# Altium project STM8L-Nrf-remote.PrjPcb
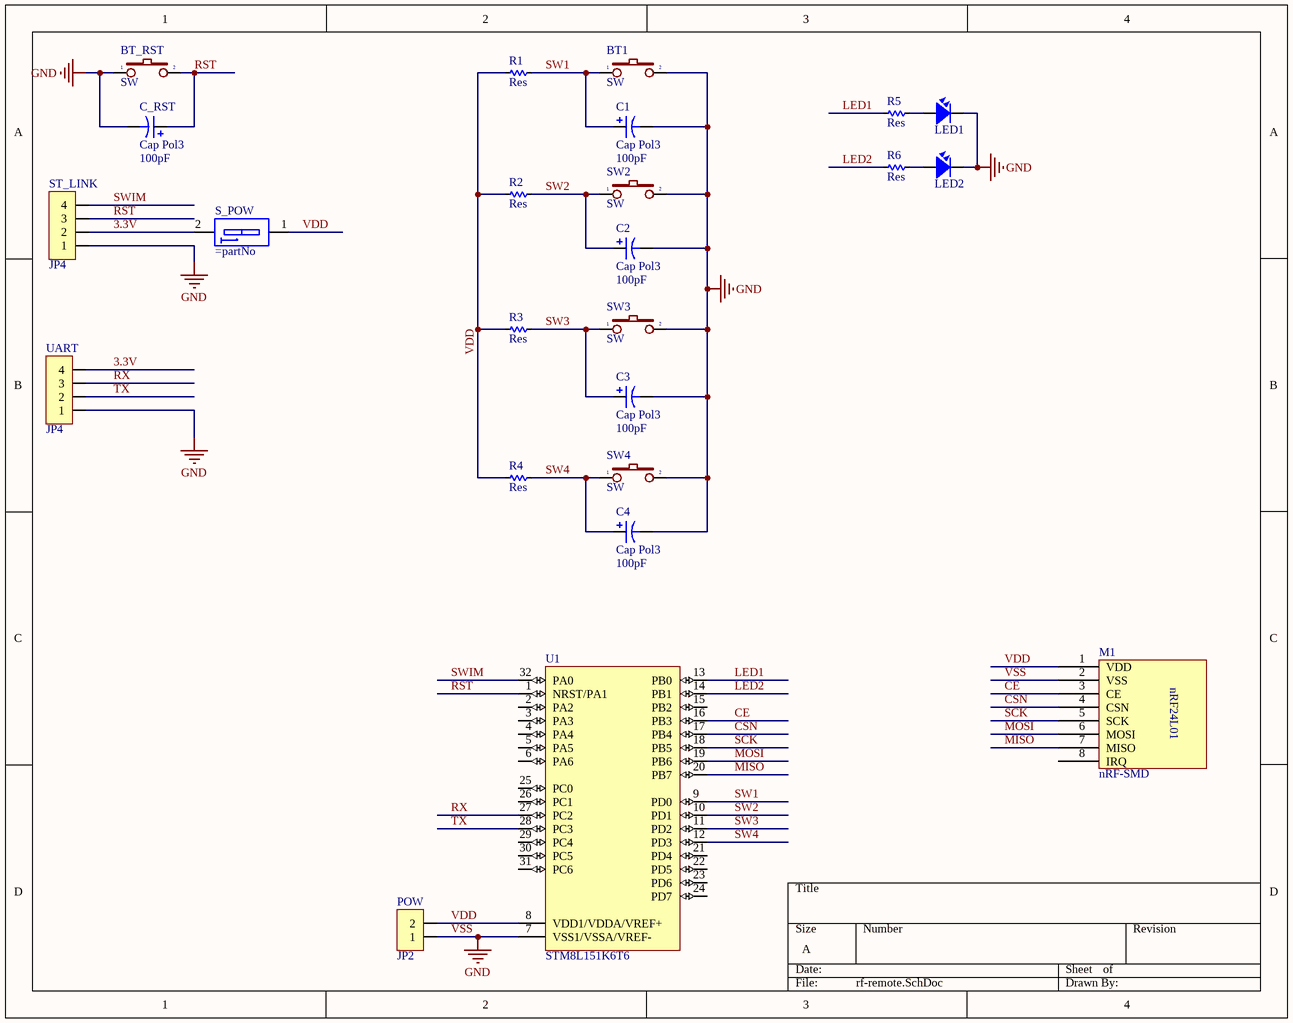
[diagram p0: rf-remote.SchDoc]
1 sheet, 24 parts. Net scope: global (net labels, ports and power ports of the same name join across sheets).
Board file: rf-remote.PcbDoc

## Sheet rf-remote.SchDoc
size A

### Parts
BT1  SW  [SW1-SMD]
BT_RST  SW  [SW1-SMD]
C1  Cap Pol3  value 100pF  [C0805]
C2  Cap Pol3  value 100pF  [C0805]
C3  Cap Pol3  value 100pF  [C0805]
C4  Cap Pol3  value 100pF  [C0805]
C_RST  Cap Pol3  value 100pF  [C0805]
LED1  LED  [LED-0805-Blue]  (value not drawn)
LED2  LED  [LED-0805-Blue]  (value not drawn)
M1  nRF-SMD  [nRF-SMD]
POW  JP2  [JP2-D1T]
R1  Res  [RES-SMD-0805]
R2  Res  [RES-SMD-0805]
R3  Res  [RES-SMD-0805]
R4  Res  [RES-SMD-0805]
R5  Res  [RES-SMD-0805]
R6  Res  [RES-SMD-0805]
S_POW  (no value)  [SW-DIP1-1]
ST_LINK  JP4  [JP4-C1T]
SW2  SW  [SW1-SMD]
SW3  SW  [SW1-SMD]
SW4  SW  [SW1-SMD]
U1  STM8L151K6T6  [LQFP32_N]
UART  JP4  [JP4-C1T]

### Nets
VSS: BT1.2 BT_RST.1 C1.2 C2.2 C3.2 C4.2 C_RST.2 LED1.2 LED2.2 M1.2(VSS) POW.1 ST_LINK.1 SW2.2 SW3.2 SW4.2 U1.7(VSS1/VSSA/VREF-) UART.1  [also labelled GND]
3.3V: S_POW.2 ST_LINK.2 UART.4
CE: M1.3(CE) U1.16(PB3)
CSN: M1.4(CSN) U1.17(PB4)
LED1: R5.2 U1.13(PB0)
LED2: R6.2 U1.14(PB1)
MISO: M1.7(MISO) U1.20(PB7)
MOSI: M1.6(MOSI) U1.19(PB6)
RST: BT_RST.2 C_RST.1 ST_LINK.3 U1.1(NRST/PA1)
RX: U1.27(PC2) UART.3
SCK: M1.5(SCK) U1.18(PB5)
SW1: BT1.1 C1.1 R1.1 U1.9(PD0)
SW2: C2.1 R2.1 SW2.1 U1.10(PD1)
SW3: C3.1 R3.1 SW3.1 U1.11(PD2)
SW4: C4.1 R4.1 SW4.1 U1.12(PD3)
SWIM: ST_LINK.4 U1.32(PA0)
TX: U1.28(PC3) UART.2
VDD: M1.1(VDD) POW.2 R1.2 R2.2 R3.2 R4.2 S_POW.1 U1.8(VDD1/VDDA/VREF+)
NetLED1_1: LED1.1 R5.1
NetLED2_1: LED2.1 R6.1

Not connected (* = marked no-connect by the designer): M1 8(IRQ); U1 2(PA2) 3(PA3) 4(PA4) 5(PA5) 6(PA6) 15(PB2) 21(PD4) 22(PD5) 23(PD6) 24(PD7) 25(PC0) 26(PC1) 29(PC4) 30(PC5) 31(PC6)

### Notes on the sheet
- (in symbol nRF-SMD) nRF24L01

### Library data of the parts
BT1 BT_RST SW2-SW4 = SW2: Switch button 2 pin; Value: SW chip 2 pin
C1-C4 C_RST = Cap Pol3: Polarized Capacitor (Surface Mount); Published: 8-Jun-2000; LatestRevisionDate: 29-May-2009; LatestRevisionNote: IPC-7351 Footprint Added.; PackageReference: C0805; Publisher: Altium Limited; PackageDescription: Chip Capacitor
LED1 LED2 = LED SMD: Value: LED 3 - 5 ly 2 Colour
M1 = nRF-SMD: MODULE nRF24L01; Value: Jac DC
POW = JP2: WR-PHD 2.54 mm Angled Socket Header; Manufacturer: W¨¹rth Elektronik eiSos GmbH; partNo: 613002143121; ComponentLink1 Description: Manufacturer; ComponentLink2 Description: Datasheet; NoPins: 02; Created Date: 29 March 2013; ComponentLink1URL: http://www.we-online.com; ComponentLink2URL: http://katalog.we-online.de/em/datasheet/6130xx143121.pdf; Created by: Karrer Zheng
R1-R6 = Res-SMD: Resistor; Manufacturer: Generic Components; Class: Passive; Published: 08/06/2000; Publisher: Altium Hobart Technology Centre
S_POW = SWDIP1: WS-DITV 2.54 mm small compact THT flat actuator with top tape; Manufacturer: Wurth Elektronik; Part No.: 418127160901; ComponentLink1 Description: Manufacturer; ComponentLink2 Description: Datasheet; Pole: 01; Created Date: Dec.2015; ComponentLink1URL: http://www.we-online.com; ComponentLink2URL: http://katalog.we-online.de/em/datasheet/4181271609xx.pdf; Created by: Baojun Chen
ST_LINK UART = JP4: WR-PHD 2.54 mm Angled Socket Header; Manufacturer: W¨¹rth Elektronik eiSos GmbH; partNo: 613004143121; ComponentLink1 Description: Manufacturer; ComponentLink2 Description: Datasheet; NoPins: 04; Created Date: 29 March 2013; ComponentLink1URL: http://www.we-online.com; ComponentLink2URL: http://katalog.we-online.de/em/datasheet/6130xx143121.pdf; Created by: Karrer Zheng
U1 = STM8L151K6T6: STM8L ARM-based EnergyLite 8-bit MCU, 32 kB Flash, 2 kB Internal RAM, -40 to +85°C Temperature, 32-pin LQFP, Tray; PackageVersion: 2010; PackageReference: LQFP32; PackageDescription: 32-Pin Low Profile Quad Flat Pack, 7 x 7 mm Body, 0.8 mm Pitch; ComponentLink1Description: Manufacturer URL; ComponentLink1URL: http://www.st.com/; ComponentLink2Description: STM8L151/152,x4,x6 Datasheet; ComponentLink2URL: http://www.st.com/internet/com/TECHNICAL_RESOURCES/TECHNICAL_LITERATURE/DATASHEET/CD00240181.pdf; ComponentLink3Description: STM8L Family Web Page; ComponentLink3URL: http://www.st.com/internet/mcu/subclass/1381.jsp